# EAGLE design illuminator_base (EAGLE 6.3)
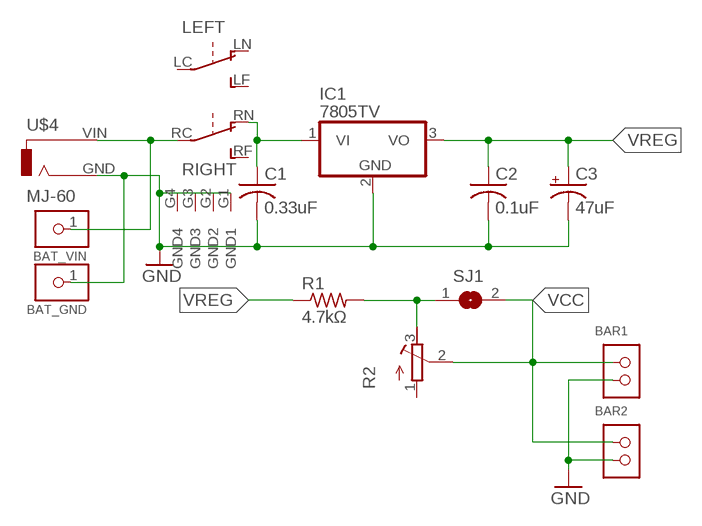
[diagram p0: schematic, sheet 1]

## Parts
BAR1  1X020.8L  [1X02_0.8_UNSIGNED_LONG]
BAR2  1X020.8L  [1X02_0.8_UNSIGNED_LONG]
BAT_GND  1X0108L  [1X01_0.8_UNSIGNED_LONG]
BAT_VIN  1X0108L  [1X01_0.8_UNSIGNED_LONG]
C1  0.33uF  C-US025-030X050  [C025-030X050]
C2  0.1uF  C-US025-030X050  [C025-030X050]
C3  47uF  CPOL-USE2-5  [E2-5]
IC1  7805TV  [TO220V]
R1  4.7kΩ  R-US_0204/7  [0204/7]
R2  R-TRIMM3339P  [RTRIM3339P]
SJ1  SJ  [SJ]
U$3  M-2022NB  [M-2022NB]
U$4  MJ-60  [MJ-60]

## Nets
GND: BAR1.2 BAR2.2 BAT_GND.1 C1.2 C2.2 C3.- IC1.2(GND) U$3.G1(GND1) U$3.G2(GND2) U$3.G3(GND3) U$3.G4(GND4) U$4.GND
N$1: R1.2 R2.3(A) SJ1.1
N$3 [VIN]: C1.1 IC1.1(VI) U$3.RN(RIGHT_ON)
VCC: BAR1.1 BAR2.1 R2.2(S) SJ1.2
VIN [VIN]: BAT_VIN.1 U$3.RC(RIGHT_CENTER) U$4.VIN
VREG [5V]: C2.1 C3.+ IC1.3(VO) R1.1
Unconnected: R2.1(E) U$3.LC(LEFT_CENTER) U$3.LF(LEFT_OFF) U$3.LN(LEFT_ON) U$3.RF(RIGHT_OFF)

## Library data of the parts
BAR1 BAR2 = PIN:1X02
BAT_GND BAT_VIN = PIN:1X01
C1 C2 = rcl:C-US: CAPACITOR, American symbol
C3 = rcl:CPOL-US: POLARIZED CAPACITOR, American symbol
IC1 = linear:78*: Positive VOLTAGE REGULATOR Source: http://cache.national.com/ds/LM/LM78L05.pdf http://www.fairchildsemi.com/ds/LM/LM7805.pdf
R1 = rcl:R-US_: RESISTOR, American symbol
R2 = resistor:R-TRIMM: Trimm resistor
SJ1 = jumper:SJ: SMD solder JUMPER
U$3 = SWITCH:M-2022NB
U$4 = JACK:MJ-60

## Net classes
1 VIN: width 0.406 mm
2 5V: width 0.254 mm

## Board
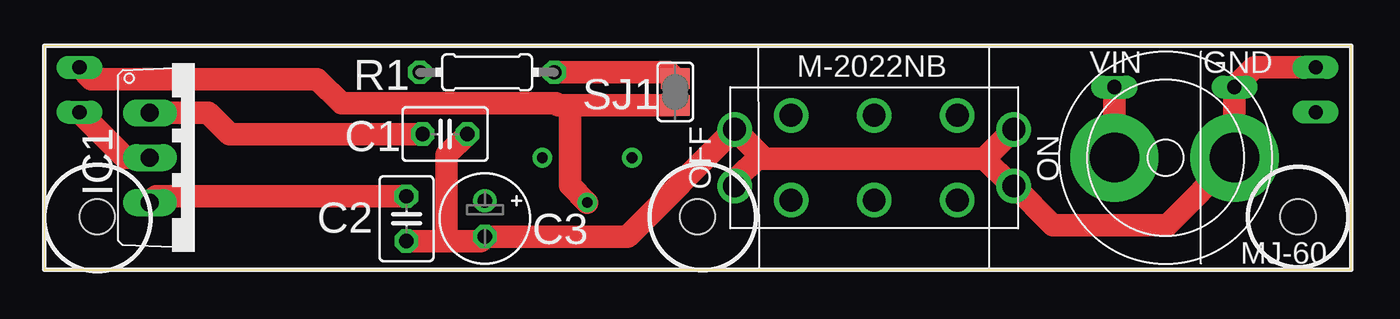
[diagram p1: board, top side]
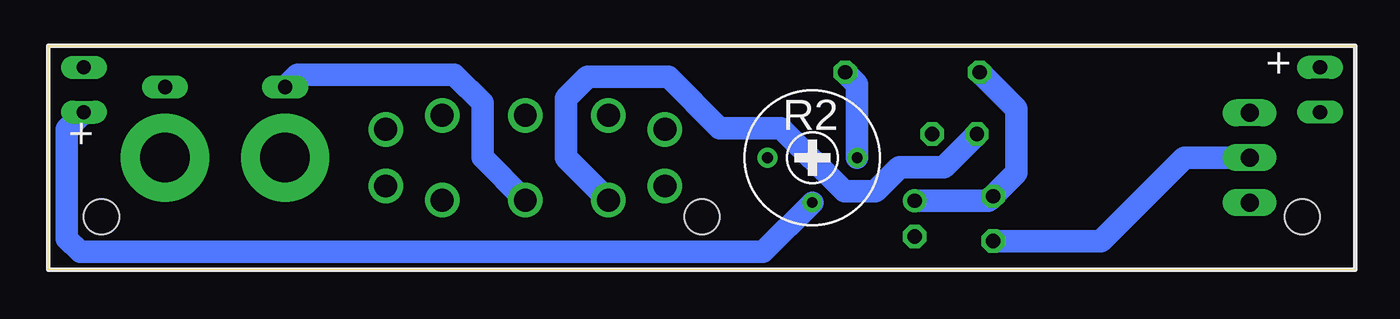
[diagram p2: board, bottom side, seen from below]

Size 74 x 12.7 mm. Coordinates in mm from the lower left corner, seen from the top.
Outline: 0,0 74,0 74,12.7 0,12.7 0,0
Copper layers (1*16): Top 0.035mm / dielectric 1.5mm / Bottom 0.035mm
Design rules "Fusion_eagle_rule_v1.1": minimum track width 6mil, minimum drill 12mil, track to track 6mil, track to pad 6mil, pad to pad 6mil, via to via 6mil, smd to smd 0mil, copper to edge 10mil, drill to drill 10mil, minimum pad ring 10mil, minimum via ring 6mil, stop-mask expansion 2mil, vias tented up to drill 100mil, thermal gap 10mil
Holes 2 mm at 71,3 37,3 3,3

### Footprints (pad centres in the part's own frame; a part is rotated, then mirrored left to right if it is on the bottom)
1X02_0.8_UNSIGNED_LONG = drill 0.8 long: 1 -2.54,0; 2 0,0
1X01_0.8_UNSIGNED_LONG = drill 0.8 long: 1 0,0
C025-030X050 = drill 0.813 octagon: 1 -1.27,0; 2 1.27,0
E2-5 = drill 0.813 pad 1.27: + -1.016,0 | drill 0.813 pad 1.27 octagon: - 1.016,0
TO220V = drill 1.016 long: 1 -2.54,-2.54; 2 0,-2.54; 3 2.54,-2.54
0204/7 = drill 0.813 octagon: 1 -3.81,0; 2 3.81,0
RTRIM3339P = drill 0.61: 1 -2.54,0; 2 0,-2.54; 3 2.54,0
SJ = smd 1.168 x 1.6: 1 -0.762,0; 2 0.762,0
M-2022NB = drill 1.3: G1 1.6,7.9; G2 -1.6,7.9; G3 -1.6,-7.9; G4 1.6,-7.9; LC -2.4,0; LF -2.4,4.7; LN -2.4,-4.7; RC 2.4,0; RF 2.4,4.7; RN 2.4,-4.7
MJ-60 = drill 2.8 pad 5: GND 0,-3.9; VIN 0,2.9

### Placement (x,y rotation side)
BAR1  72,11.47 90 top
BAR2  2,8.93 270 top
BAT_GND  67.4,10.35 90 top
BAT_VIN  60.6,10.35 90 top
C1  22.7,7.69 0 top
C2  20.52,2.9 270 top
C3  24.96,2.9 270 top
IC1  8.52,6.35 270 top
R1  25.08,11.19 0 top
R2  30.75,6.35 0 bottom
SJ1  35.74,10.07 270 top
U$3  47,6.35 270 top
U$4  63.5,6.35 90 top

### Tracks (layer width: path | path; a pad name or v marks a point on that pad's centre or on a via)
GND
  Top 1.27: BAR1.2 68.52,11.47 BAT_GND.1 U$4.GND 63.59,2.54 57.11,2.54 U$3.G1 54.8,4.75 53.25,6.3 | C2.2 22.78,1.63 | 22.78,1.63 24.71,1.63 C3.- 33.03,1.88 U$3.G3 40.56,6.49 | BAR2.2 4.58,6.35 IC1.2 | C1.2 22.78,6.5 22.78,1.63 | U$3.G2 53.25,6.3 | 53.25,6.3 40.75,6.3 40.56,6.49 | U$3.G4 39.1,5.04 40.56,6.49
  Bottom 1.27: C2.2 14.4,1.63 9.68,6.35 IC1.2
N$1
  Top 1.27: SJ1.1 35.38,11.19 R1.2
  Bottom 1.27: R2.3 28.21,10.51 R1.2
N$3
  Top 1.27: C1.1 10.49,7.69 9.3,8.89 IC1.1
  Bottom 1.27: U$3.RN 44.7,6.35 44.7,9.7 43.48,10.92 38.89,10.92 35.99,8.03 32.51,8.03 28.93,4.45 27.18,4.45 25.81,5.82 23.31,5.82 C1.1
VCC
  Top 1.27: BAR2.1 2.67,10.79 15.47,10.79 16.84,9.42 28.98,9.42 29.09,9.31 29.77,9.31 | 29.77,9.31 SJ1.2 | R2.2 29.77,4.79 29.77,9.31
  Bottom 1.27: BAR1.1 72.97,7.96 72.97,1.78 72.21,1.02 33.54,1.02 R2.2
VIN
  Top 1.27: BAT_VIN.1 U$4.VIN
  Bottom 1.27: U$3.RC 49.43,6.38 49.43,9.45 51.03,11.05 59.9,11.05 BAT_VIN.1
VREG
  Top 1.27: IC1.3 6.34,4.17 C2.1
  Bottom 1.27: C3.+ 20.77,3.92 C2.1 19.2,5.49 19.2,9.12 R1.1

### Text on the board
tPlace: M-2022NB | VIN | GND | R1 | SJ1 | IC1 | C1 | C2 | C3 | MJ-60
bPlace: + | R2 | +